# EAGLE design logger_smt_v1.0 (EAGLE 7.1.0)
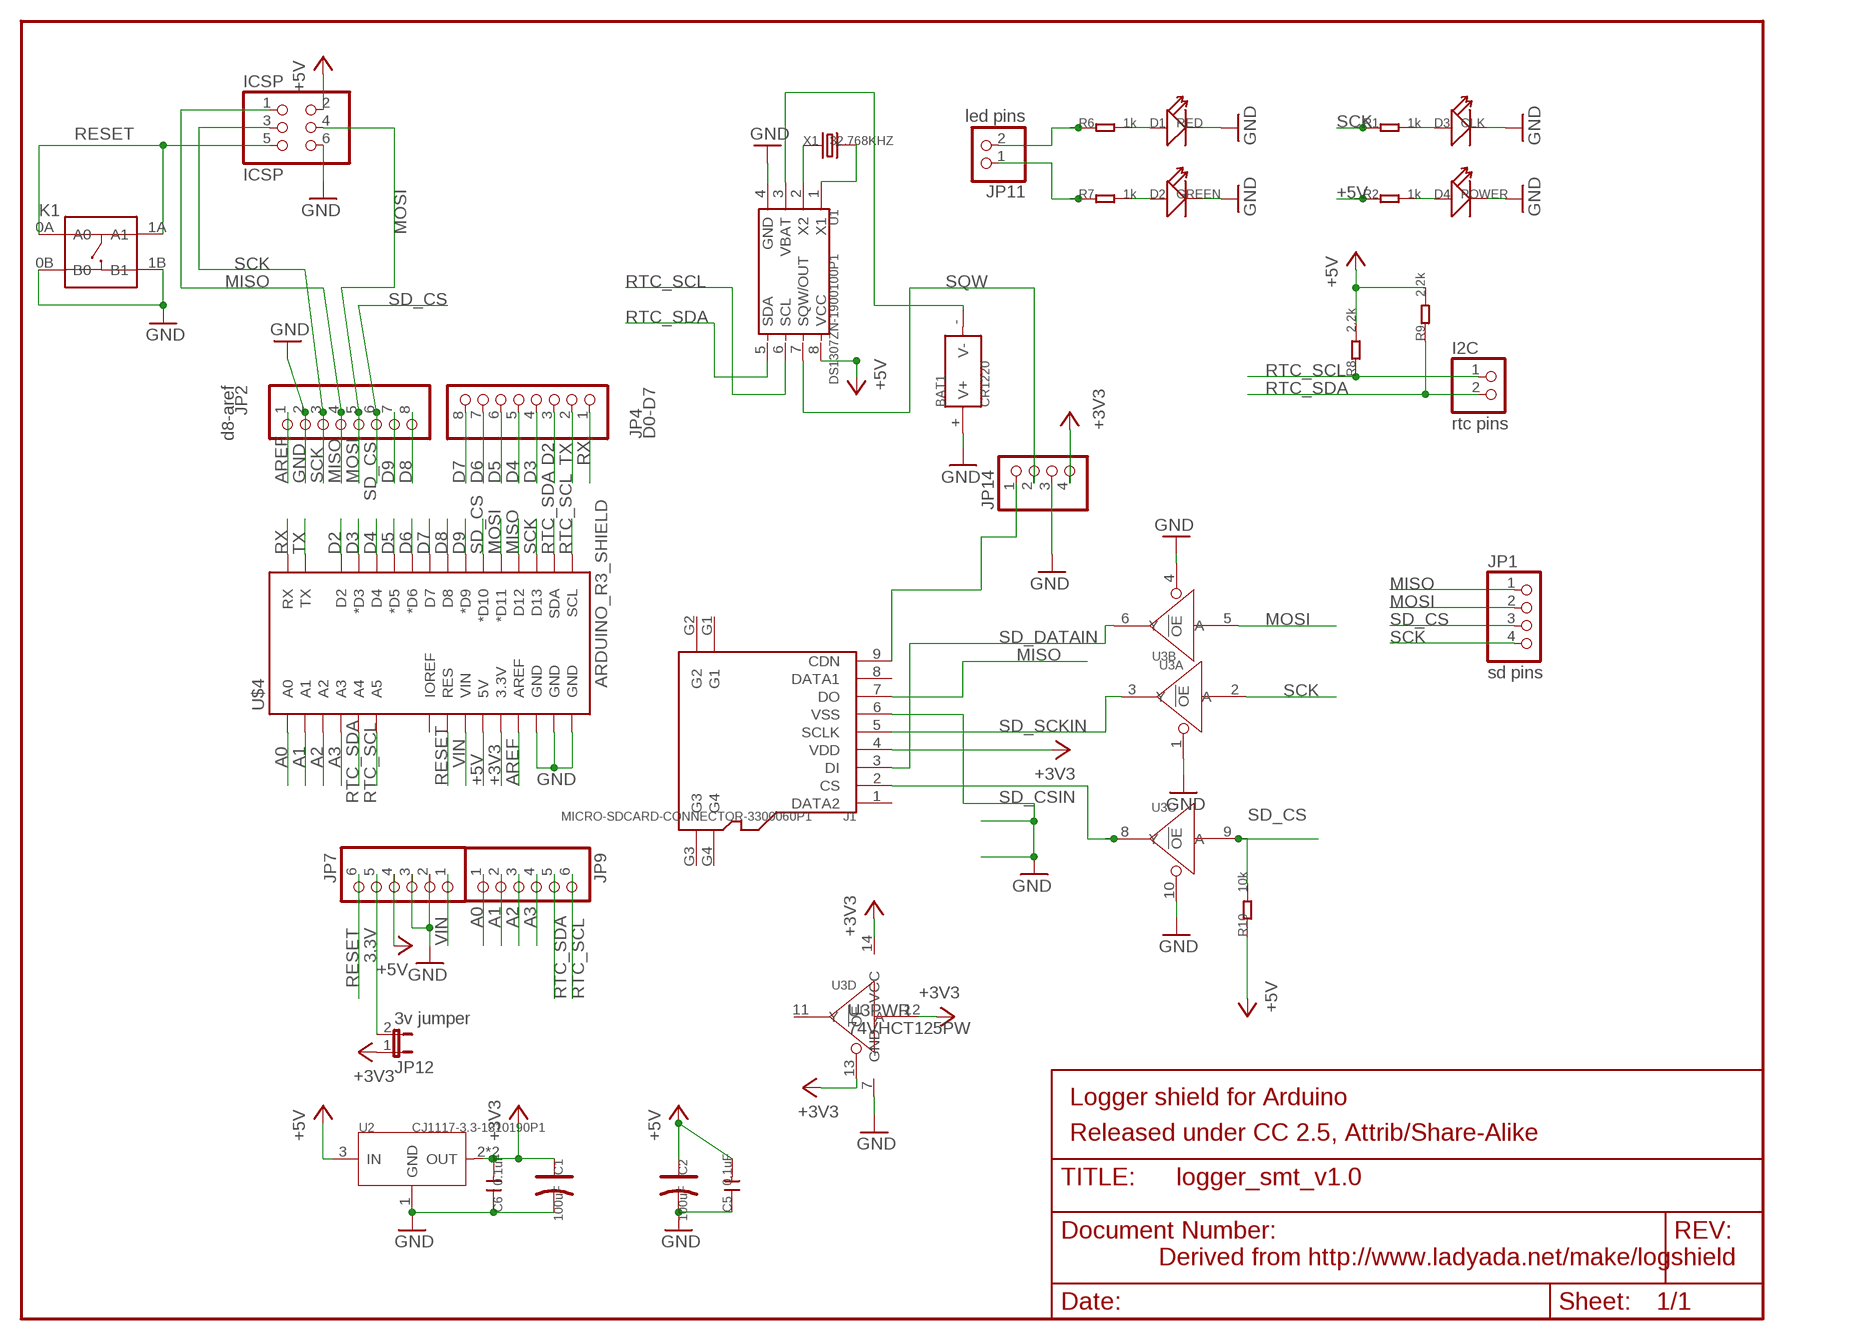
[diagram p0: schematic, sheet 1]

## Parts
BAT1  CR1220  BAT-HOLDER-SMD-1220  [PLASTIC-CR1220-L15.06XW13.0XH4.1MM]
C1  100uF  CAP-ELECTRO-B  [ELECTRO-SMD-B-4.8MM]
C2  100uF  CAP-ELECTRO-B  [ELECTRO-SMD-B-4.8MM]
C5  0.1uF  C-0603  [C0603]
C6  0.1uF  C-0603  [C0603]
D1  RED  LED'0603'  [LED-0603]
D2  GREEN  LED'0603'  [LED-0603]
D3  CLK  LED'0603'  [LED-0603]
D4  POWER  LED'0603'  [LED-0603]
I2C  rtc pins  PINHD-1X2  [1X02]
ICSP  ICSP  PINHD-2X3  [2X03]
J1  MICRO-SDCARD-CONNECTOR-3300060P1  [9P-SMD-W-RING]
JP1  sd pins  PINHD-1X4  [1X04]
JP2  d8-aref  PINHD-1X8BIG  [1X08-BIG]
JP4  D0-D7  PINHD-1X8BIG  [1X08-BIG]
JP7  PINHD-1X6B  [1X06-BIG]
JP9  PINHD-1X6B  [1X06-BIG]
JP11  led pins  PINHD-1X2  [1X02]
JP12  3v jumper  JP1E  [JP1]
JP14  PINHD-1X4  [1X04]
K1  BUTTON-4P-6X6-SMD  [4P-SMD-6.2X6.2X4H]
R1  1k  R-0603  [R0603]
R2  1k  R-0603  [R0603]
R6  1k  R-0603  [R0603]
R7  1k  R-0603  [R0603]
R8  2.2k  R-0603  [R0603]
R9  2.2k  R-0603  [R0603]
R10  10k  R-0603  [R0603]
U1  DS1307ZN-1900100P1  [SOIC8]
U2  CJ1117-3.3-1310190P1  [SOT223]
U3  74VHCT125PW  [TSSOP14]
U$4  ARDUINO_R3_SHIELD  [UNO_R3_SHIELD]
X1  32.768KHZ  CRYSTAL-3215  [2P-SMD-3.2X1.5]

## Nets
3.3V: JP7.5 JP12.2
+3V3 [3V3]: C1.+ C6.2 J1.4(VDD) JP12.1 JP14.4 U2.2(OUT) U2.TER(OUT) U3.12(D:A) U3.13(D:!OE) U3.14(PWR:VCC) U$4.3.3V
+5V [5V]: C2.+ C5.2 ICSP.2 JP7.4 R2.1 R8.2 R9.2 R10.1 U1.8(VCC) U2.3(IN) U$4.5V
A0: JP9.1 U$4.A0
A1: JP9.2 U$4.A1
A2: JP9.3 U$4.A2
A3: JP9.4 U$4.A3
AREF [GND]: JP2.1 U$4.AREF
D2: JP4.3 U$4.D2
D3: JP4.4 U$4.D3(*D3)
D4: JP4.5 U$4.D4
D5: JP4.6 U$4.D5(*D5)
D6: JP4.7 U$4.D6(*D6)
D7: JP4.8 U$4.D7
D8: JP2.8 U$4.D8
D9: JP2.7 U$4.D9(*D9)
GND [GND]: BAT1.+(V+) C1.- C2.- C5.1 C6.1 D1.- D2.- D3.- D4.- ICSP.6 J1.6(VSS) JP2.2 JP7.2 JP7.3 JP14.3 K1.0B(B0) K1.1B(B1) U1.4(GND) U2.1(GND) U3.1(A:!OE) U3.4(B:!OE) U3.7(PWR:GND) U3.10(C:!OE) U$4.GND@0(GND) U$4.GND@1(GND) U$4.GND@2(GND)
MISO: ICSP.1 J1.7(DO) JP1.1 JP2.4 U$4.D12
MOSI: ICSP.4 JP1.2 JP2.5 U3.5(B:A) U$4.D11(*D11)
N$1: BAT1.-(V-) U1.3(VBAT)
N$2: U1.2(X2) X1.1
N$3: U1.1(X1) X1.2
N$14: D1.+ R6.2
N$17: JP11.2 R6.1
N$18: D2.+ R7.2
N$20: JP11.1 R7.1
N$26: D3.+ R1.2
N$40: D4.+ R2.2
RESET: ICSP.5 JP7.6 K1.0A(A0) K1.1A(A1) U$4.RES
RTC_SCL: I2C.1 JP9.6 R8.1 U1.6(SCL) U$4.A5 U$4.SCL
RTC_SDA: I2C.2 JP9.5 R9.1 U1.5(SDA) U$4.A4 U$4.SDA
RX: JP4.1 U$4.RX
SCK: ICSP.3 JP1.4 JP2.3 R1.1 U3.2(A:A) U$4.D13
SD_CD: J1.9(CDN) JP14.1
SD_CS: JP1.3 JP2.6 R10.2 U3.9(C:A) U$4.D10(*D10)
SD_CSIN: J1.2(CS) U3.8(C:Y)
SD_DATAIN: J1.3(DI) U3.6(B:Y)
SD_SCKIN: J1.5(SCLK) U3.3(A:Y)
SQW: JP14.2 U1.7(SQW/OUT)
TX: JP4.2 U$4.TX
VIN: JP7.1 U$4.VIN
Unconnected: J1.1(DATA2) J1.8(DATA1) J1.G1 J1.G2 J1.G3 J1.G4 U3.11(D:Y) U$4.IOREF

## Notes on the sheet
- Logger shield for Arduino
- Released under CC 2.5, Attrib/Share-Alike
- Derived from http://www.ladyada.net/make/logshield

## Library data of the parts
BAT1 = Connector:BAT-HOLDER: METAL-CR1220-D13.5*H5.0MM:320170002;METAL-CR1632-SMD:320170007;METAL-CR2032-D20.0*H6.3MM:320170003;METAL-CR2032-SMD:320170006;PLASTIC-CR1220-L15.06*W13.0*H4.1MM:320170000;PLASTIC-CR2032-L25.2*W15.6*H5.2MM:320170005
C1 C2 = Discrete:CAP*: Electrolytic Capacitors,Tantalum Capacitors and Super Capacitors
C5 C6 = Discrete:C*: Ceramic Capacitors
D1-D4 = Discrete:LED*
I2C JP11 = pinhead:PINHD-1X2: PIN HEADER
ICSP = pinhead:PINHD-2X3: PIN HEADER
J1 = OPL:MICRO-SDCARD-CONNECTOR: Micro SD Card
JP1 JP14 = pinhead:PINHD-1X4: PIN HEADER
JP2 JP4 = adafruit:PINHD-1X8: PIN HEADER
JP7 JP9 = adafruit:PINHD-1X6: PIN HEADER
JP12 = jumper:JP1E: JUMPER
K1 = Discrete:BUTTON-4P
R1 R2 R6-R10 = Discrete:R*
U1 = OPL:DS1307ZN: 34X8 serial Real-Time Clock
U2 = OPL:CJ1117-3.3: 1A Low Dropout Linear Regulator
U3 = IC:74V*125: Quad Buffer/Line Driver;3-state
U$4 = SparkFun-Boards:ARDUINO_R3_SHIELD: Shield form compatible with the Arduino Uno R3.
X1 = Discrete:CRYSTAL*: CRYSTAL

## Net classes
0 default: width 0.152 mm, drill 0.33 mm
1 3V3: width 0.305 mm, drill 0.33 mm, clearance 0.152 mm to class 0
2 5V: width 0.305 mm, drill 0.33 mm, clearance 0.152 mm to class 0, clearance 0.152 mm to class 1
3 GND: width 0.152 mm, drill 0.33 mm, clearance 0.152 mm to class 0, clearance 0.152 mm to class 1, clearance 0.152 mm to class 2

## Board
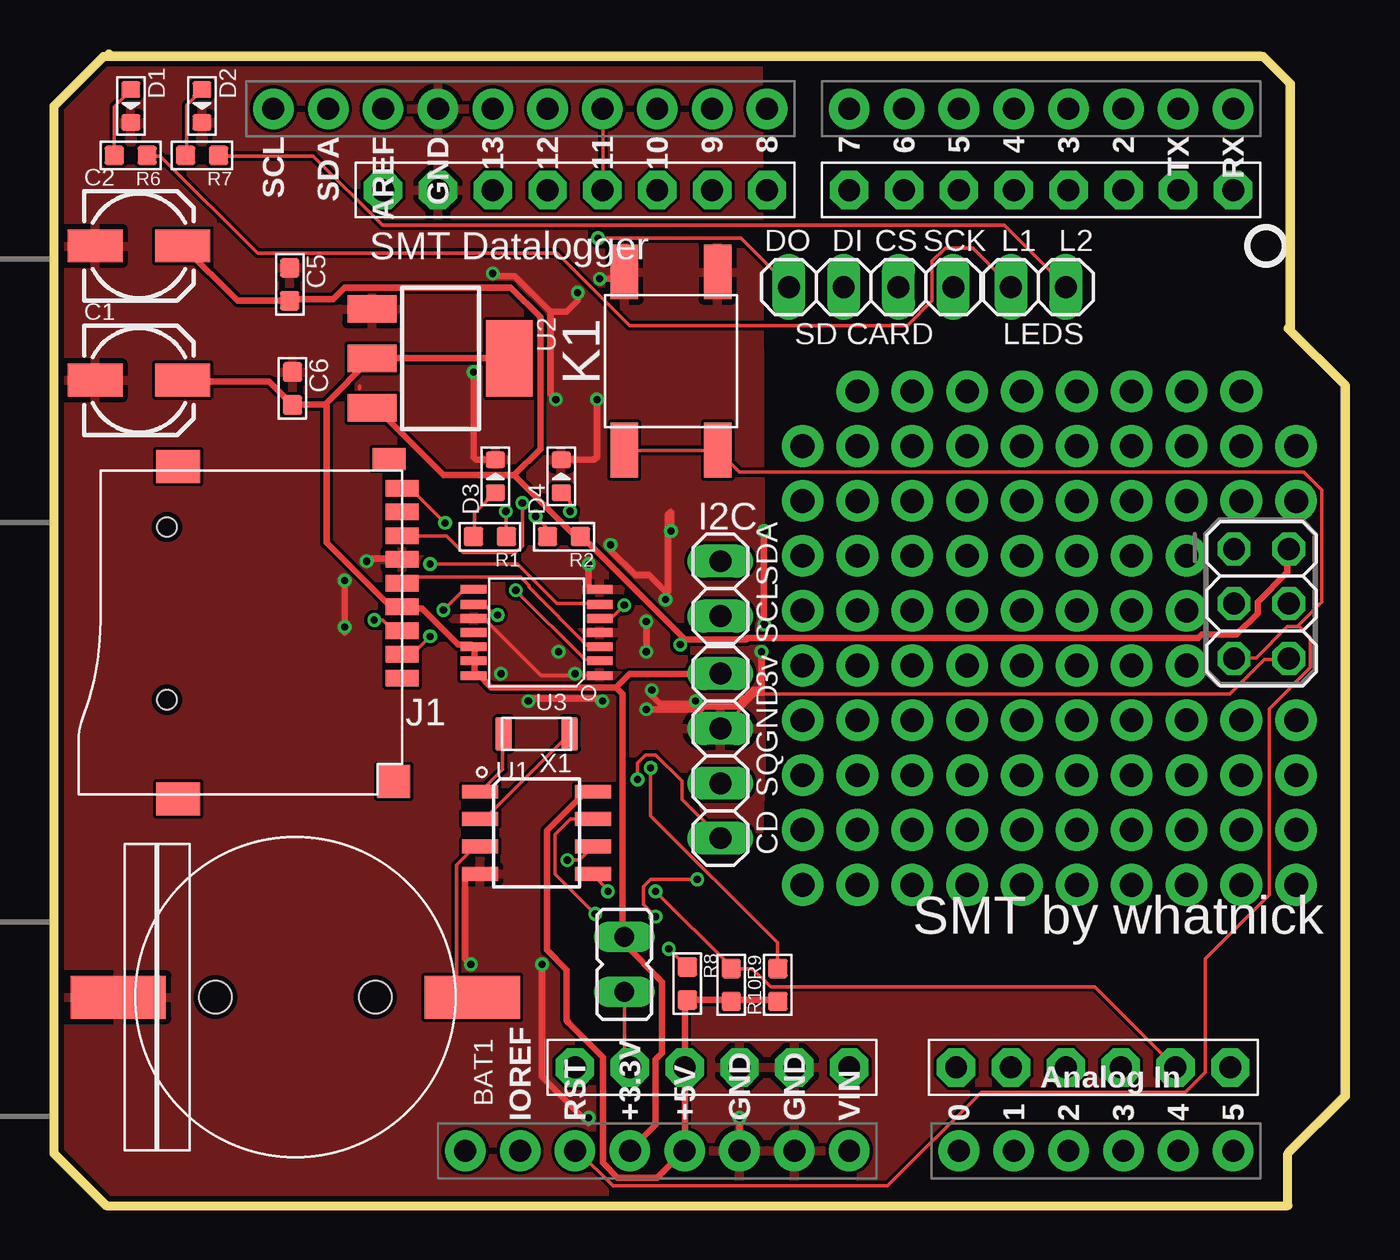
[diagram p1: board, top side]
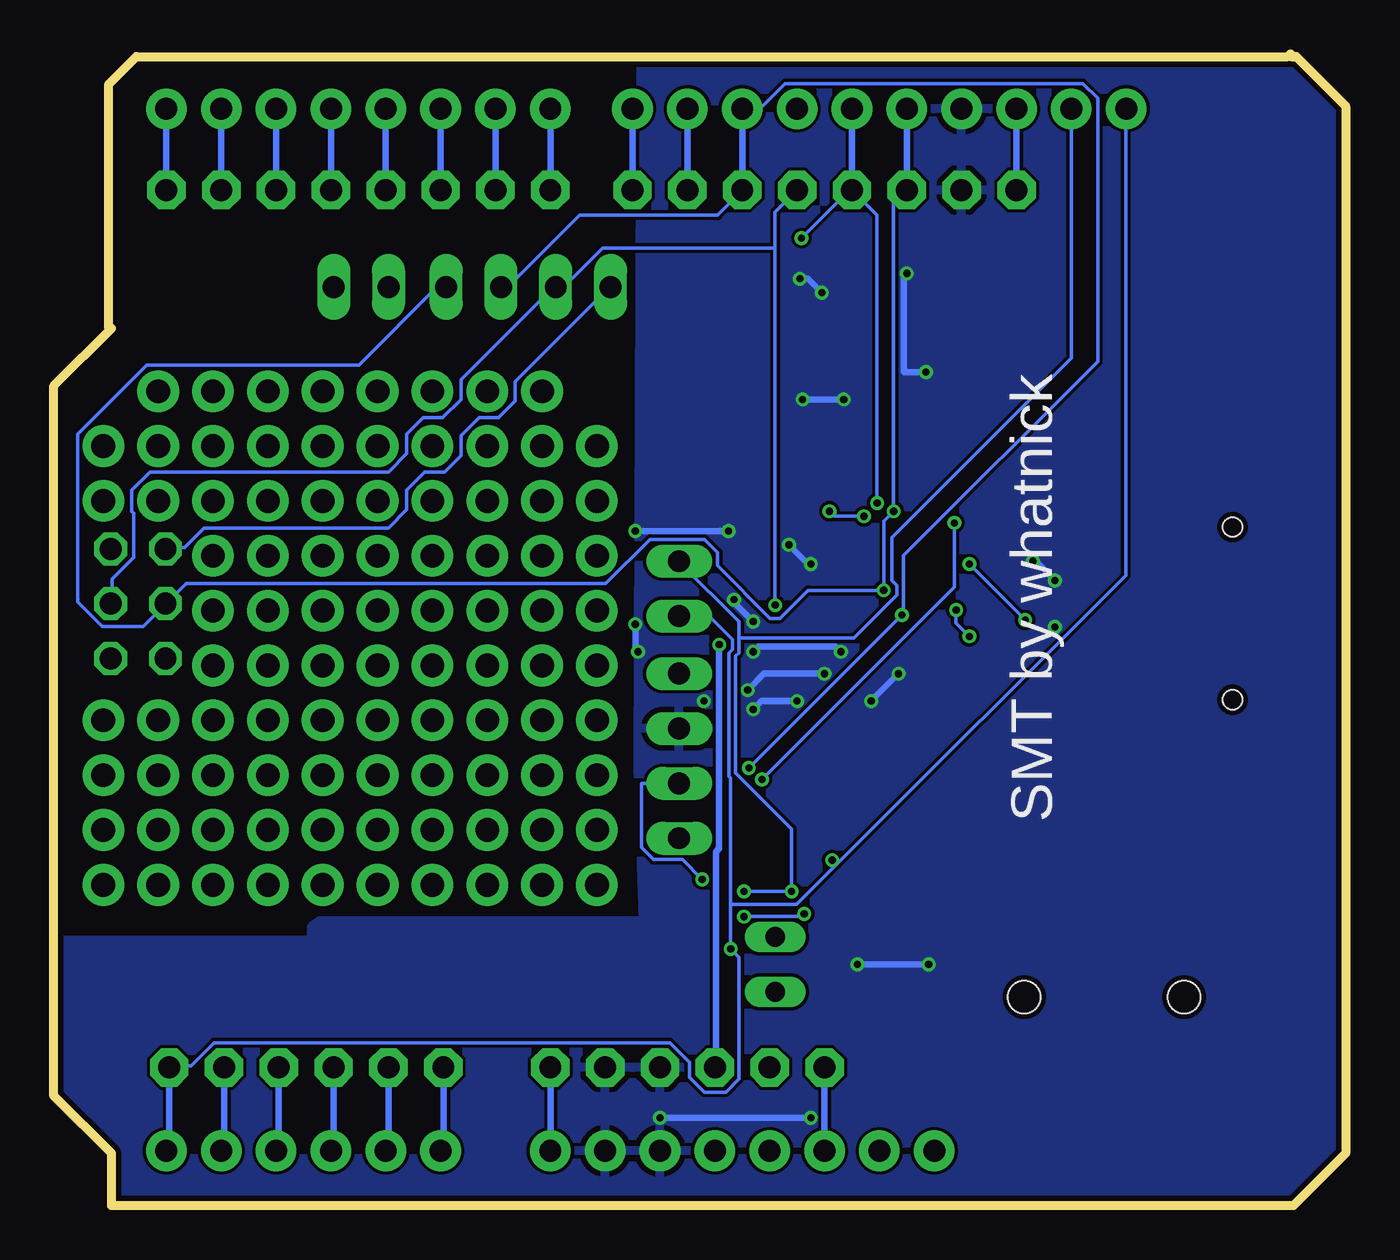
[diagram p2: board, bottom side, seen from below]

Size 59.82 x 53.34 mm. Coordinates in mm from the lower left corner, seen from the top.
Outline: 59.74,5.09 59.74,5.1
Outline: 2.54,53.21 2.29,53.21 0,50.93 0,2.41 2.41,0 57.15,0 57.15,2.41 59.82,5.08 59.82,37.97 57.15,40.64
Outline: 57.28,40.64 57.28,51.94 56.01,53.21 2.67,53.21 2.54,53.34
Copper layers (1*16): Top 0.035mm / dielectric 1.5mm / Bottom 0.035mm
Design rules "SeeedStudio_2layer_DRU_no_angle_20140221": minimum track width 6mil, minimum drill 12mil, track to track 6mil, track to pad 6mil, pad to pad 6mil, via to via 6mil, smd to smd 0mil, copper to edge 10mil, drill to drill 10mil, minimum pad ring 10mil, minimum via ring 6mil, stop-mask expansion 2mil, vias tented up to drill 100mil, thermal gap 10mil

### Footprints (pad centres in the part's own frame; a part is rotated, then mirrored left to right if it is on the bottom)
PLASTIC-CR1220-L15.06XW13.0XH4.1MM = smd 2 x 4.4: + 0,-8.2; - 0,8.2 | hole 1.5: 0,3.7; 0,-3.7
ELECTRO-SMD-B-4.8MM = smd 2.54 x 1.524: + 2.032,0; - -2.032,0
C0603 = smd 0.889 x 0.889: 1 -0.762,0; 2 0.762,0
LED-0603 = smd 0.762 x 0.889: + -0.762,0; - 0.762,0
1X02 = drill 1.016 long: 1 -1.27,0; 2 1.27,0
2X03 = drill 1.016 octagon: 1 -2.54,-1.27; 2 -2.54,1.27; 3 0,-1.27; 4 0,1.27; 5 2.54,-1.27; 6 2.54,1.27
9P-SMD-W-RING = smd 1.524 x 0.762: 1 -7.493,2.114; 2 -7.493,1.014; 3 -7.493,-0.086; 4 -7.493,-1.186; 5 -7.493,-2.286; 6 -7.493,-3.386; 7 -7.493,-4.486; 8 -7.493,-5.586; 9 -7.493,-6.686 | smd 1.524 x 1.016: G1 -6.893,-8.032 | smd 2.032 x 1.524: G2 2.88,-7.686; G3 2.88,7.714 | smd 1.524 x 1.524: G4 -7.101,6.895 | hole 0.889: 3.407,-4.886; 3.407,3.114
1X04 = drill 1.016 long: 1 -3.81,0; 2 -1.27,0; 3 1.27,0; 4 3.81,0
1X08-BIG = drill 1.016 pad 1.778 octagon: 1 -8.89,0; 2 -6.35,0; 3 -3.81,0; 4 -1.27,0; 5 1.27,0; 6 3.81,0; 7 6.35,0; 8 8.89,0
1X06-BIG = drill 1.016 pad 1.778 octagon: 1 -6.35,0; 2 -3.81,0; 3 -1.27,0; 4 1.27,0; 5 3.81,0; 6 6.35,0
JP1 = drill 0.914 long: 1 0,-1.27; 2 0,1.27
4P-SMD-6.2X6.2X4H = smd 2.54 x 1.27: 0A -4.129,2.159; 0B 4.129,2.159; 1A -4.129,-2.159; 1B 4.129,-2.159
R0603 = smd 0.889 x 0.889: 1 -0.762,0; 2 0.762,0
SOIC8 = smd 1.651 x 0.635: 1 -2.616,1.905; 2 -2.616,0.635; 3 -2.616,-0.635; 4 -2.616,-1.905; 5 2.616,-1.905; 6 2.616,-0.635; 7 2.616,0.635; 8 2.616,1.905
SOT223 = smd 1.27 x 2.286: 1 -2.286,-3.175; 2 0,-3.175; 3 2.286,-3.175 | smd 3.556 x 2.159: TER 0,3.175
TSSOP14 = smd 0.4 x 1.2: 1 -2,-2.925; 2 -1.3,-2.925; 3 -0.65,-2.925; 4 0,-2.925; 5 0.65,-2.925; 6 1.3,-2.925; 7 2,-2.925; 8 2,2.925; 9 1.3,2.925; 10 0.65,2.925; 11 0,2.925; 12 -0.65,2.925; 13 -1.3,2.925; 14 -2,2.925
UNO_R3_SHIELD = drill 1.016 pad 1.88: 3.3V 50.8,26.67; 5V 50.8,29.21; A0 50.8,41.91; A1 50.8,44.45; A2 50.8,46.99; A3 50.8,49.53; A4 50.8,52.07; A5 50.8,54.61; AREF 2.54,15.24; D2 2.54,49.53; D3 2.54,46.99; D4 2.54,44.45; D5 2.54,41.91; D6 2.54,39.37; D7 2.54,36.83; D8 2.54,33.02; D9 2.54,30.48; D10 2.54,27.94; D11 2.54,25.4; D12 2.54,22.86; D13 2.54,20.32; GND@0 50.8,31.75; GND@1 50.8,34.29; GND@2 2.54,17.78; IOREF 50.8,21.59; NC 50.8,19.05; RES 50.8,24.13; RX 2.54,54.61; SCL 2.54,10.16; SDA 2.54,12.7; TX 2.54,52.07; VIN 50.8,36.83
2P-SMD-3.2X1.5 = smd 0.762 x 1.524: 1 -1.524,0; 2 1.524,0

### Placement (x,y rotation side)
BAT1  11.18,9.65 270 top
C1  3.94,38.23 0 top
C2  3.94,44.45 0 top
C5  10.92,42.67 270 top
C6  11.05,37.85 270 top
D1  3.56,50.93 270 top
D2  6.86,50.93 270 top
D3  20.45,33.78 90 top
D4  23.5,33.78 90 top
I2C  30.86,28.57 90 top
ICSP  55.92,27.88 270 top
J1  8.64,26.54 180 top
JP1  37.85,42.55 0 top
JP2  24.13,47.04 0 top
JP4  45.72,47.04 180 top
JP7  30.48,6.4 180 top
JP9  48.13,6.4 0 top
JP11  45.59,42.55 180 top
JP12  26.42,11.18 180 top
JP14  30.86,20.83 90 top
K1  28.57,39.12 90 top
R1  20.19,30.99 180 top
R2  23.62,30.99 180 top
R6  3.56,48.64 180 top
R7  6.86,48.64 180 top
R8  29.34,10.29 270 top
R9  31.37,10.22 270 top
R10  33.53,10.22 90 top
U1  22.35,17.27 0 top
U2  17.91,39.24 270 top
U3  22.35,26.54 90 top
U$4  0,53.34 270 top
X1  22.35,21.84 180 top

### Tracks (layer width: path | path; a pad name or v marks a point on that pad's centre or on a via)
3.3V
  Top 0.152: JP12.2 26.42,6.63 26.64,6.4 JP7.5
+3V3
  Top 0.305: 12.55,37.11 11.1,37.11 C6.2 9.96,38.18 5.99,38.18 C1.+ | 12.55,37.11 14.68,39.24 U2.2 U2.TER | U$4.3.3V 27.86,3.73 27.86,6.78 28.17,7.09 28.17,10.36 26.42,12.12 JP12.1 26.34,12.57 26.34,23.7 26.04,24 | 26.04,24 26.64,24.61 30.84,24.61 JP14.4 | 26.04,24 20.24,24 19.63,24.61 U3.14 19.48,24.61 19.48,25.22 U3.13 19.48,25.38 19.48,25.83 U3.12 19.33,25.98 18.72,25.98 17.04,27.66 16.13,27.66 J1.4 16.05,27.81 15.52,27.81 12.62,30.71 12.62,37.03 12.55,37.11
+5V  (via drill 0.33)
  Top 0.305: R10.1 33.5,9.53 31.45,9.53 R9.2 31.37,9.53 R8.2 29.24,9.45 29.24,6.4 JP7.4 29.24,6.33 29.24,2.67 U$4.5V 29.16,2.52 27.94,1.29 26.11,1.29 25.43,1.98 25.43,6.86 23.82,8.46 23.75,8.59 23.75,10.92 22.83,11.84 22.83,17.37 24.49,19.02 U1.8 24.97,19.13 24.59,19.13 | C2.+ 8.51,41.91 C5.2 11.02,41.99 12.93,41.99 13.46,42.52 21.16,42.52 22.53,41.15 22.53,35.05 21.31,33.83 | 21.31,33.83 24.13,31.01 24.36,31.01 R2.1 24.51,30.94 29.24,26.21 | 21.31,33.83 18.03,33.83 14.91,36.96 U2.3 | 29.24,26.21 32.06,26.21 32.13,26.29 53.01,26.29 53.16,26.44 54.76,26.44 55.75,27.43 55.75,27.96 57.12,29.34 57.12,30.4 ICSP.2 | 29.24,26.21 v29.01,25.98
  Bottom 0.305: v29.01,25.98 29.01,16.54 29.16,16.38 29.16,6.4 JP7.4
A0
  Bottom 0.305: JP9.1 41.78,2.67 U$4.A0
A1
  Bottom 0.305: JP9.2 44.32,2.67 U$4.A1
A2
  Bottom 0.305: JP9.3 46.86,2.67 U$4.A2
A3
  Bottom 0.305: JP9.4 49.4,2.67 U$4.A3
AREF
  Bottom 0.305: U$4.AREF JP2.1
D2
  Bottom 0.305: U$4.D2 JP4.3
D3
  Bottom 0.305: U$4.D3 JP4.4
D4
  Bottom 0.305: U$4.D4 JP4.5
D5
  Bottom 0.305: U$4.D5 JP4.6
D6
  Bottom 0.305: U$4.D6 JP4.7
D7
  Bottom 0.305: U$4.D7 JP4.8
D8
  Bottom 0.305: U$4.D8 JP2.8
D9
  Bottom 0.305: U$4.D9 JP2.7
GND  (via drill 0.33)
  Top 0.152: ICSP.6 57.12,25.3 56.06,25.3 54.46,23.7 32.51,23.7 30.91,22.1 JP14.3 | D3.- 20.47,34.59 20.45,34.59 | U3.10 19.43,27.18 19.99,27.18 19.99,27.13 22.55,24.56 25.27,24.56 U3.1 | D3.- | 14.15,37.85 14.15,37.95 | 20.47,24.51 v20.7,24.64
  Top 0.305: v22.61,11.18 22.61,5.97 24.76,3.81 v24.76,4.06 | v19.3,11.18 19.05,11.43 19.05,15.37 U1.4 | U$4.GND@0 v31.75,4.06 | v29.72,23.37 29.72,23.24 28.07,23.24 27.69,23.62 v27.69,23.88 | 28.32,28.45 27.56,29.21 26.92,29.21 25.78,30.35 v25.78,30.61 | v28.32,28.07 28.32,28.45 | v27.43,25.65 v27.43,27.05 | v24.76,29.72 24.76,28.7 24.89,28.57 25.27,28.57 U3.7 | v25.15,37.34 25.15,34.67 25.02,34.54 D4.- | v23.24,37.34 22.99,37.59 22.99,41.4 | 22.99,41.4 21.34,43.05 20.32,43.05 v20.32,43.18 | v19.43,38.61 19.43,34.67 19.56,34.54 D3.- | 22.99,41.4 23.75,41.4 24.26,41.91 v24.26,42.29 | v25.27,42.93 26.42,42.93 K1.0B | 28.32,28.45 28.45,28.45 28.45,32 28.57,32.13 v28.57,31.24 | v32.89,26.92 v32.89,31.24 | v32.77,25.65 32.77,23.88 32.39,23.88 32.39,23.75 32.26,23.75 32.26,23.62 32.13,23.62 32.13,23.5 31.88,23.5 31.88,23.24 31.75,23.24 31.75,23.11 29.97,23.11 29.97,22.99 v27.43,22.99 | v25.4,23.37 25.27,23.5 21.97,23.5 v21.97,23.37 | v13.46,28.96 v13.46,26.8 13.46,26.54 | v14.48,29.84 14.61,29.97 16.13,29.97 J1.6
  Bottom 0.305: v19.3,11.18 v22.61,11.18 | v31.75,4.06 v24.76,4.06 | v27.69,23.88 26.92,24.64 v24.13,24.64 | v28.32,28.07 28.32,27.94 v27.43,27.05 | v27.43,25.65 27.18,25.91 23.62,25.91 v23.37,25.65 | v25.78,30.61 24.89,29.72 v24.76,29.72 | v23.24,37.34 v25.15,37.34 | v20.32,43.18 20.45,43.05 20.45,38.61 v19.43,38.61 | v24.26,42.29 24.89,42.93 v25.27,42.93 | v32.89,31.24 v28.57,31.24 | v32.89,26.92 32.89,25.65 v32.77,25.65 | v27.43,22.99 27.05,23.37 v25.4,23.37 | v20.7,24.64 v21.97,23.37 | v13.46,28.96 14.35,29.84 v14.48,29.84
  pour Top: 59.69,-0.25 59.94,12.32 47.88,12.32 47.88,12.95 47.5,13.21 32.51,13.21 32.77,20.32 32.64,53.59 0.51,53.47 0.63,-0.38
  pour Bottom: 59.69,-0.25 59.94,12.32 47.88,12.32 47.88,12.95 47.5,13.21 32.51,13.21 32.77,20.32 32.64,53.59 0.51,53.47 0.63,-0.38
MISO  (via drill 0.33)
  Top 0.152: v21.69,32.54 21.69,30.56 21.39,30.25 18.95,30.25 18.19,31.01 16.13,31.01 J1.7 | v25.2,44.81 31.83,44.81 34.04,42.6 JP1.1
  Bottom 0.152: v21.69,32.54 21.69,45.87 JP2.4 22.99,47.02 v25.2,44.81 | ICSP.1 54.61,30.48 53.77,30.48 52.86,31.39 44.32,31.39 43.48,32.23 43.48,33.15 42.65,33.98 41.73,33.98 40.97,34.75 40.97,35.66 40.13,36.5 39.22,36.5 38.46,37.26 38.46,38.18 34.04,42.6 JP1.1
  Bottom 0.305: U$4.D12 JP2.4
MOSI  (via drill 0.33)
  Top 0.152: v26.42,27.81 25.81,27.2 25.35,27.2 U3.5 | U$4.D11 25.43,50.75 25.43,47.09 JP2.5
  Bottom 0.152: 26.42,44.35 26.42,46.02 JP2.5 | 26.42,44.35 v26.42,27.81 | 26.42,44.35 34.42,44.35 36.17,42.6 36.55,42.6 JP1.2 36.63,42.6 40.97,38.25 40.97,37.34 41.81,36.5 42.72,36.5 43.48,35.74 43.48,34.82 44.32,33.98 55.37,33.98 56.21,33.15 56.21,32.16 56.13,32.08 56.13,30.02 57.12,29.03 57.12,27.89 ICSP.4
N$1
  Top 0.152: U1.3 19.71,16.61 19.48,16.61 18.64,15.77 18.64,10.36 19.33,9.68 BAT1.-
N$2
  Top 0.152: X1.1 19.94,17.91 U1.2
N$3
  Top 0.152: X1.2 20.78,21.79 20.78,20.19 19.79,19.2 U1.1
N$4  (via drill 1.1 pad 1.93)
  other vias: 34.67,30.1
N$5  (via drill 1.1 pad 1.93)
  other vias: 39.75,37.72
N$6  (via drill 1.1 pad 1.93)
  other vias: 42.29,37.72
N$7  (via drill 1.1 pad 1.93)
  other vias: 37.21,37.72
N$8  (via drill 1.1 pad 1.93)
  other vias: 34.67,35.18
N$9  (via drill 1.1 pad 1.93)
  other vias: 44.83,37.72
N$10  (via drill 1.1 pad 1.93)
  other vias: 34.67,32.64
N$11  (via drill 1.1 pad 1.93)
  other vias: 47.37,35.18
N$12  (via drill 1.1 pad 1.93)
  other vias: 34.67,17.4
N$13  (via drill 1.1 pad 1.93)
  other vias: 52.45,32.64
N$14
  Top 0.152: R6.2 2.79,50.9 3.56,51.66 D1.+
N$16  (via drill 1.1 pad 1.93)
  other vias: 47.37,37.72
N$17
  Top 0.152: R6.1 4.32,48.62 4.93,48.62 9.42,44.12 23.29,44.12 26.64,40.77 39.52,40.77 40.67,41.91 40.67,43.74 41.28,44.35 42.57,44.35 44.32,42.6 JP11.2
N$18
  Top 0.152: D2.+ 6.15,50.98 6.15,48.69 R7.2
N$19  (via drill 1.1 pad 1.93)
  other vias: 49.91,37.72
N$20
  Top 0.152: R7.1 7.67,48.62 12.01,48.62 15.21,45.41 44.02,45.41 46.84,42.6 JP11.1
N$21  (via drill 1.1 pad 1.93)
  other vias: 52.45,30.1
N$22  (via drill 1.1 pad 1.93)
  other vias: 52.45,27.56
N$23  (via drill 1.1 pad 1.93)
  other vias: 52.45,25.02
N$24  (via drill 1.1 pad 1.93)
  other vias: 52.45,35.18
N$25  (via drill 1.1 pad 1.93)
  other vias: 49.91,35.18
N$26
  Top 0.152: R1.2 19.48,31.01 19.48,32.08 20.4,32.99 D3.+
N$27  (via drill 1.1 pad 1.93)
  other vias: 44.83,35.18
N$28  (via drill 1.1 pad 1.93)
  other vias: 42.29,35.18
N$29  (via drill 1.1 pad 1.93)
  other vias: 39.75,35.18
N$30  (via drill 1.1 pad 1.93)
  other vias: 37.21,35.18
N$31  (via drill 1.1 pad 1.93)
  other vias: 37.21,32.64
N$32  (via drill 1.1 pad 1.93)
  other vias: 39.75,32.64
N$33  (via drill 1.1 pad 1.93)
  other vias: 42.29,32.64
N$34  (via drill 1.1 pad 1.93)
  other vias: 44.83,32.64
N$35  (via drill 1.1 pad 1.93)
  other vias: 47.37,32.64
N$36  (via drill 1.1 pad 1.93)
  other vias: 49.91,32.64
N$37  (via drill 1.1 pad 1.93)
  other vias: 52.45,14.86
N$38  (via drill 1.1 pad 1.93)
  other vias: 54.99,37.72
N$40  (via drill 0.33)
  Top 0.152: v22.3,31.93 22.83,31.39 22.83,31.01 R2.2 | v23.9,32.16 23.9,32.61 D4.+
  Bottom 0.152: v22.3,31.93 23.67,31.93 v23.9,32.16
N$41  (via drill 1.1 pad 1.93)
  other vias: 54.99,17.4
N$42  (via drill 1.1 pad 1.93)
  other vias: 37.21,30.1
N$43  (via drill 1.1 pad 1.93)
  other vias: 39.75,30.1
N$44  (via drill 1.1 pad 1.93)
  other vias: 42.29,30.1
N$45  (via drill 1.1 pad 1.93)
  other vias: 44.83,30.1
N$46  (via drill 1.1 pad 1.93)
  other vias: 47.37,30.1
N$47  (via drill 1.1 pad 1.93)
  other vias: 49.91,30.1
N$49  (via drill 1.1 pad 1.93)
  other vias: 54.99,14.86
N$51  (via drill 1.1 pad 1.93)
  other vias: 44.83,14.86
N$52  (via drill 1.1 pad 1.93)
  other vias: 54.99,32.64
N$53  (via drill 1.1 pad 1.93)
  other vias: 57.53,14.86
N$54  (via drill 1.1 pad 1.93)
  other vias: 57.53,17.4
N$56  (via drill 1.1 pad 1.93)
  other vias: 49.91,27.56
N$57  (via drill 1.1 pad 1.93)
  other vias: 47.37,27.56
N$58  (via drill 1.1 pad 1.93)
  other vias: 44.83,27.56
N$59  (via drill 1.1 pad 1.93)
  other vias: 42.29,27.56
N$60  (via drill 1.1 pad 1.93)
  other vias: 39.75,27.56
N$61  (via drill 1.1 pad 1.93)
  other vias: 37.21,27.56
N$62  (via drill 1.1 pad 1.93)
  other vias: 57.53,22.48
N$63  (via drill 1.1 pad 1.93)
  other vias: 57.53,19.94
N$64  (via drill 1.1 pad 1.93)
  other vias: 52.45,19.94
N$65  (via drill 1.1 pad 1.93)
  other vias: 54.99,22.48
N$66  (via drill 1.1 pad 1.93)
  other vias: 37.21,25.02
N$67  (via drill 1.1 pad 1.93)
  other vias: 39.75,25.02
N$68  (via drill 1.1 pad 1.93)
  other vias: 42.29,25.02
N$69  (via drill 1.1 pad 1.93)
  other vias: 44.83,25.02
N$70  (via drill 1.1 pad 1.93)
  other vias: 47.37,25.02
N$71  (via drill 1.1 pad 1.93)
  other vias: 49.91,25.02
N$72  (via drill 1.1 pad 1.93)
  other vias: 57.53,35.18
N$73  (via drill 1.1 pad 1.93)
  other vias: 57.53,32.64
N$74  (via drill 1.1 pad 1.93)
  other vias: 52.45,37.72
N$75  (via drill 1.1 pad 1.93)
  other vias: 49.91,14.86
N$76  (via drill 1.1 pad 1.93)
  other vias: 47.37,14.86
N$77  (via drill 1.1 pad 1.93)
  other vias: 39.75,14.86
N$78  (via drill 1.1 pad 1.93)
  other vias: 37.21,22.48
N$79  (via drill 1.1 pad 1.93)
  other vias: 39.75,22.48
N$80  (via drill 1.1 pad 1.93)
  other vias: 42.29,22.48
N$81  (via drill 1.1 pad 1.93)
  other vias: 44.83,22.48
N$82  (via drill 1.1 pad 1.93)
  other vias: 47.37,22.48
N$83  (via drill 1.1 pad 1.93)
  other vias: 49.91,22.48
N$84  (via drill 1.1 pad 1.93)
  other vias: 52.45,22.48
N$85  (via drill 1.1 pad 1.93)
  other vias: 37.21,14.86
N$86  (via drill 1.1 pad 1.93)
  other vias: 42.29,14.86
N$91  (via drill 1.1 pad 1.93)
  other vias: 54.99,19.94
N$92  (via drill 1.1 pad 1.93)
  other vias: 49.91,19.94
N$93  (via drill 1.1 pad 1.93)
  other vias: 47.37,19.94
N$94  (via drill 1.1 pad 1.93)
  other vias: 44.83,19.94
N$95  (via drill 1.1 pad 1.93)
  other vias: 42.29,19.94
N$96  (via drill 1.1 pad 1.93)
  other vias: 39.75,19.94
N$97  (via drill 1.1 pad 1.93)
  other vias: 37.21,19.94
N$102  (via drill 1.1 pad 1.93)
  other vias: 37.21,17.4
N$103  (via drill 1.1 pad 1.93)
  other vias: 39.75,17.4
N$104  (via drill 1.1 pad 1.93)
  other vias: 42.29,17.4
N$105  (via drill 1.1 pad 1.93)
  other vias: 44.83,17.4
N$106  (via drill 1.1 pad 1.93)
  other vias: 47.37,17.4
N$107  (via drill 1.1 pad 1.93)
  other vias: 49.91,17.4
N$109  (via drill 1.1 pad 1.93)
  other vias: 52.45,17.4
N$112  (via drill 1.1 pad 1.93)
  other vias: 34.67,27.56
N$113  (via drill 1.1 pad 1.93)
  other vias: 34.67,25.02
N$114  (via drill 1.1 pad 1.93)
  other vias: 34.67,22.48
N$115  (via drill 1.1 pad 1.93)
  other vias: 34.67,19.94
N$116  (via drill 1.1 pad 1.93)
  other vias: 34.67,14.86
N$117  (via drill 1.1 pad 1.93)
  other vias: 54.99,35.18
RESET
  Top 0.152: K1.0A 26.42,34.98 30.68,34.98 K1.1A 30.76,34.98 31.75,33.98 57.89,33.98 58.73,33.15 58.73,27.96 57.62,26.86 | 57.62,26.86 57.58,26.82 57.12,26.82 55.68,25.38 54.69,25.38 ICSP.5 | 57.62,26.86 58.19,26.29 58.19,24.92 56.29,23.01 56.29,14.4 53.31,11.43 53.31,6.17 52.4,5.26 42.95,5.26 38.61,0.91 25.88,0.91 24.28,2.52 24.13,2.52 U$4.RES
  Bottom 0.305: JP7.6 U$4.RES
RTC_SCL  (via drill 0.33)
  Top 0.152: v28.47,11.89 29.31,11.05 R8.1 | U1.6 24.33,16 v23.77,16
  Bottom 0.152: 28.47,13.95 28.47,19.81 28.55,19.89 28.55,25.6 28.4,25.76 28.4,26.21 29.46,27.28 30.84,27.28 I2C.1 | 28.47,13.95 v28.47,11.89 28.09,11.51 28.09,5.87 28.7,5.26 29.69,5.26 30.38,5.94 30.38,6.63 31.29,7.54 52.4,7.54 53.47,6.48 54.38,6.48 JP9.6 | 23.57,15.8 25.43,13.95 28.47,13.95 | 23.57,15.8 10.18,29.18 10.18,50.75 U$4.SCL | 23.57,15.8 v23.77,16
  Bottom 0.305: JP9.6 54.48,2.67 U$4.A5
RTC_SDA  (via drill 0.33)
  Top 0.152: JP9.5 48.21,10.13 33.2,10.13 32.36,10.97 31.37,10.97 R9.1 31.37,11.05 v27.86,14.55 | v25.65,14.55 25.65,14.63 24.97,15.32 U1.5
  Bottom 0.152: 28.09,26.29 28.09,27.05 30.84,29.79 I2C.2 | 28.09,26.29 28.09,25.6 28.25,25.45 28.25,20.04 25.65,17.45 v25.65,14.55 v27.86,14.55 | U$4.SDA 12.7,39.24 21.01,30.94 21.01,28.96 20.78,28.73 20.78,28.27 22.76,26.29 28.09,26.29
  Bottom 0.305: JP9.5 51.94,2.67 U$4.A4
RX
  Bottom 0.305: U$4.RX JP4.1
SCK  (via drill 0.33)
  Top 0.152: v20.93,32.16 20.93,31.01 R1.1 | v21.39,28.5 24.59,25.3 25.27,25.3 U3.2
  Bottom 0.152: JP2.3 20.4,46.94 20.93,46.41 v20.93,32.16 21.39,31.7 v21.39,28.5 24.89,28.5 26.19,27.2 26.64,27.2 29.08,29.64 29.08,30.25 29.69,30.86 32.21,30.86 34.27,28.8 53.7,28.8 54.61,27.89 ICSP.3 54.69,27.81 55.68,26.82 57.58,26.82 58.73,27.96 58.73,35.74 55.52,38.94 45.7,38.94 42.11,42.52 41.66,42.52 JP1.4
  Bottom 0.305: U$4.D13 JP2.3
SD_CD  (via drill 0.33)
  Top 0.152: v18.11,31.62 16.51,33.22 J1.9 | v27.03,19.74 27.03,20.5 27.41,20.88 27.86,20.88 29.08,19.66 29.08,18.82 30.84,17.07 JP14.1
  Bottom 0.152: v18.11,31.62 18.11,28.65 v27.03,19.74
SD_CS  (via drill 0.33)
  Top 0.152: v27.64,20.27 27.64,18.06 33.5,12.19 33.5,11.05 R10.2 | v20.55,27.36 20.4,27.36 19.94,27.81 19.48,27.81 U3.9
  Bottom 0.152: JP1.3 39.06,42.6 38.76,42.6 35.48,45.87 29.08,45.87 28.02,46.94 JP2.6 | v27.64,20.27 v20.55,27.36 20.47,27.43 20.47,30.1 11.48,39.09 11.48,51.28 12.17,51.97 25.96,51.97 27.03,50.9 27.86,50.9 U$4.D10
  Bottom 0.305: U$4.D10 JP2.6
SD_CSIN  (via drill 0.33)
  Top 0.152: v18.03,27.58 18.95,28.5 19.41,28.5 U3.8 | v17.42,26.36 16.66,25.6 16.13,25.6 J1.2
  Bottom 0.152: v18.03,27.58 18.03,26.98 v17.42,26.36
SD_DATAIN  (via drill 0.33)
  Top 0.152: v17.42,29.72 21.46,29.72 23.29,27.89 25.27,27.89 U3.6 | v14.83,27.13 15.21,27.13 15.67,26.67 16.13,26.67 J1.3
  Bottom 0.152: v14.83,27.13 v17.42,29.72
SD_SCKIN
  Top 0.152: U3.3 25.27,25.91 24.74,25.91 22,28.65 22,28.73 21.62,29.11 16.36,29.11 16.13,28.88 J1.5
SQW  (via drill 0.33)
  Top 0.152: U1.7 23.93,17.91 23.22,17.2 23.22,15.37 v25.07,13.51 | v27.86,13.39 27.31,13.95 27.31,14.78 27.64,15.11 v29.79,15.11
  Bottom 0.152: v25.07,13.51 25.2,13.39 v27.86,13.39 | v29.79,15.11 30.71,16.03 32.06,16.03 32.61,16.59 32.61,19.56 JP14.2
TX
  Bottom 0.305: U$4.TX JP4.2
VIN
  Bottom 0.305: JP7.1 U$4.VIN

### Text on the board
tPlace: DO | DI | CS | SCK | L1 | L2 | SMT Datalogger | SD CARD | LEDS | SDA | SCL | 3v | GND | SQ | CD | SMT by whatnick
bPlace: SMT by whatnick